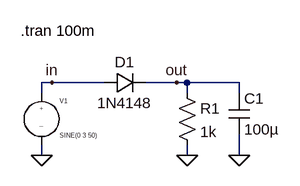
[diagram p0: schematic gleichrichter_1-kleinsignal.asc]
gleichrichter_1-kleinsignal.asc, the LTspice schematic file:
Version 4
SHEET 1 880 680
WIRE 80 144 64 144
WIRE 160 144 80 144
WIRE 272 144 224 144
WIRE 288 144 272 144
WIRE 368 144 288 144
WIRE 64 160 64 144
WIRE 288 160 288 144
WIRE 368 160 368 144
WIRE 64 256 64 240
WIRE 288 256 288 240
WIRE 368 256 368 224
FLAG 288 256 0
FLAG 64 256 0
FLAG 80 144 in
FLAG 272 144 out
FLAG 368 256 0
SYMBOL source-V 64 144 R0
WINDOW 123 0 0 Left 2
WINDOW 39 0 0 Left 2
SYMATTR InstName V1
SYMATTR Value SINE(0 3 50)
SYMBOL res 272 144 R0
SYMATTR InstName R1
SYMATTR Value 1k
SYMBOL diode 160 160 R270
WINDOW 0 32 32 VTop 2
WINDOW 3 0 32 VBottom 2
SYMATTR InstName D1
SYMATTR Value 1N4148
SYMBOL cap 352 160 R0
SYMATTR InstName C1
SYMATTR Value 100µ
TEXT 32 64 Left 2 !.tran 100m

The netlist it stands for:
* gleichrichter_1-kleinsignal.asc
V1 in 0 SINE(0 3 50)
R1 out 0 1k
D1 in out 1N4148
C1 out 0 100µ
.model D D
.lib standard.dio
.tran 100m
.backanno
.end